# Altium schematic sheet Power_supply.SchDoc
size A4; SheetNumber: 2; SheetTotal: 7
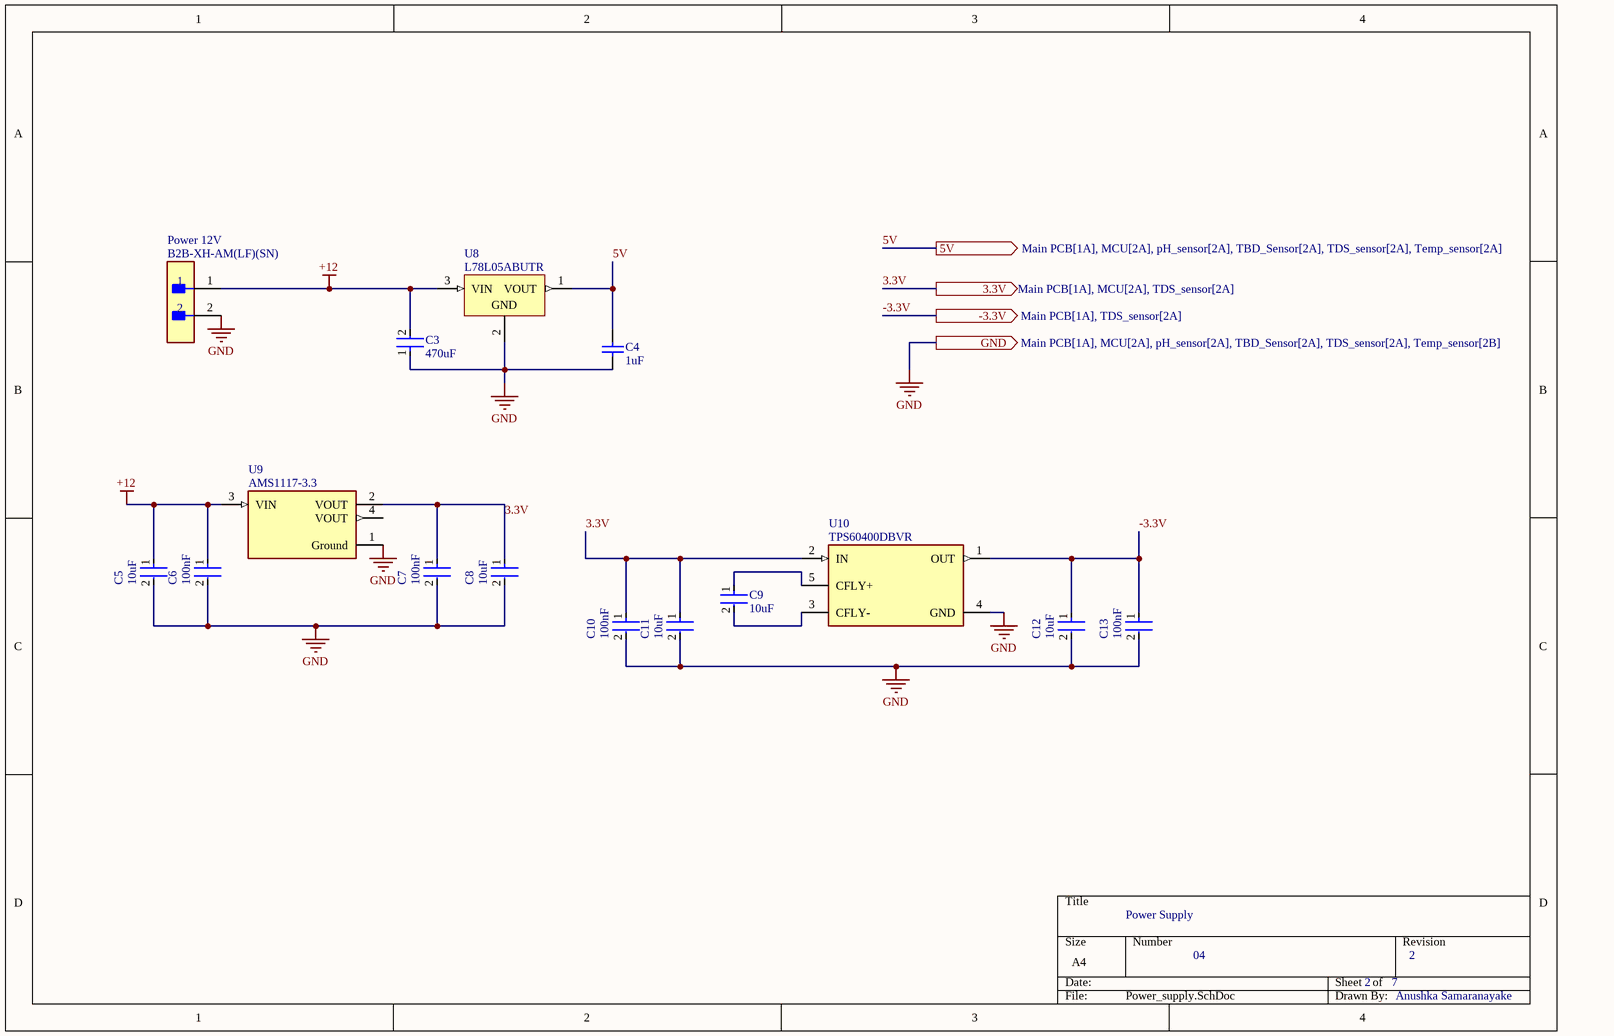
[diagram p0: Power_supply.SchDoc]

## Parts
C3  470uF  [FP-CL31-IPC_B]
C4  1uF  [CAPC2013X135X50LL15T20]
C5  10uF  [FP-CL31-IPC_B]
C6  100nF  [FP-CL31-IPC_B]
C7  100nF  [FP-CL31-IPC_B]
C8  10uF  [FP-CL31-IPC_B]
C9  10uF  [FP-CL31-IPC_B]
C10  100nF  [FP-CL31-IPC_B]
C11  10uF  [FP-CL31-IPC_B]
C12  10uF  [FP-CL31-IPC_B]
C13  100nF  [FP-CL31-IPC_B]
Power_12V  B2B-XH-AM(LF)(SN)  [FP-B2B-XH-AM_LF_SN-MFG]
U8  L78L05ABUTR  [SOT-89_N]
U9  AMS1117-3.3  [FP-AMS1117-IPC_C]
U10  TPS60400DBVR  [FP-DBV0005A-IPC_B]

## Ports
3.3V (out, see Main PCB[1A], MCU[2A], TDS_sensor[2A]), 5V (out, see Main PCB[1A], MCU[2A], pH_sensor[2A], TBD_Sensor[2A], TDS_sensor[2A], Temp_sensor[2A]), -3.3V (out, see Main PCB[1A], TDS_sensor[2A]), GND (out, see Main PCB[1A], MCU[2A], pH_sensor[2A], TBD_Sensor[2A], TDS_sensor[2A], Temp_sensor[2B])

## Nets
+12: C3.2 C5.1 C6.1 Power_12V.1 U8.3(VIN) U9.3(VIN)
GND: C3.1 C4.1 C5.2 C6.2 C7.2 C8.2 C10.2 C11.2 C12.2 C13.2 Power_12V.2 U8.2(GND) U9.1(Ground) U10.4(GND) ; port GND
3.3V: C7.1 C8.1 C10.1 C11.1 U9.2(VOUT) U10.2(IN) ; port 3.3V
5V: C4.2 U8.1(VOUT) ; port 5V
-3.3V: C12.1 C13.1 U10.1(OUT) ; port -3.3V
NetC9_1: C9.1 U10.5(CFLY+)
NetC9_2: C9.2 U10.3(CFLY-)

Not connected (* = marked no-connect by the designer): U9 4(VOUT)

## Notes on the sheet
- Power Supply
- 04
- 2
- 7
- Anushka Samaranayake

## Library data of the parts
C3 C5-C13 = CMP-13271-001731-1: Cap Ceramic 100nF 50V X7R ±10% SMD 1206 +125°C Embossed T/R; Voltage: 50V; Thickness: 0.037inch; Lead Free: Lead Free; Length: 3.2mm; Min Operating Temperature: -55°C; Package Quantity: 15000; Packaging: Tape and Reel; Mount: Surface Mount; Depth: 1.6mm; Case/Package: 1206; Voltage Rating (DC): 50V; Tolerance: 10%; Height: 0.85mm; Capacitance: 100nF; Radiation Hardening: No; Dielectric: X7R; Voltage Rating: 50V; Max Operating Temperature: 125°C; Width: 0.063inch
C4 = CMP-2007-03437-1: Manufacturer: Vitramon; Part Number: VJ0805Y102KXACW1BC
Power_12V = CMP-17439-000037-1: CONN HEADER VERT 2POS 2.5MM; Max Voltage Rating (AC): 250V; Connector Type: Male Pin; Contact Resistance: 20mR; Max Current Rating: 3A; Number of Positions: 2; Series: XH; Contact Material: Brass; Mount: Through Hole; Housing Material: Polyamide; Contact Plating: Tin; Termination: Solder; Max Operating Temperature: 85°C; Depth: 5.75mm; Packaging: Bulk; Min Operating Temperature: -25°C; Contact Type: Male Pin; Color: Green; Pitch: 2.5mm; Length: 7.4mm; Lead Free: Lead Free; Number of Rows: 1; Fastening Type: Detent; Housing Color: White; Orientation: Straight
U8 = CMP-0244-00406-1: Positive Voltage Regulator, 5V, 4-Pin SOT-89, Tape and Reel; PackageVersion: 2011; DatasheetVersion: 1/02/2011; PackageDescription: 3-Pin SOT-89 Package 1.5 mm Pitch, 4.1 mm Lead Span; PackageReference: SOT-89; ComponentLink2Description: Datasheet; ComponentLink1URL: http://www.st.com; ComponentLink1Description: Manufacturer URL; ComponentLink2URL: http://www.st.com/internet/com/TECHNICAL_RESOURCES/TECHNICAL_LITERATURE/DATASHEET/CD00000446.pdf
U9 = CMP-209535-000001-1: LDO Voltage Regulators 1A, 3.3V; Manufacturer: Advanced Monolithic Systems; Dropout Voltage: 1.1V; Output Type: Fixed; Nominal Supply Current: 5mA; Max Power Dissipation: 1.2W; Max Supply Voltage: 15V; Number Of Outputs: 1; Standoff Height: 0.64mm; Max Junction Temp: +125°C; Height: 1.8mm; Package: AMS1117; Device Class L2: Power Management ICs; ComponentLink2Description: Datasheet; ComponentLink2URL: http://www.advanced-monolithic.com/pdf/ds1117.pdf; Category: IC; RoHS: TRUE; Automotive: No; Device Class L1: Integrated Circuits (ICs); Output Current: 1A; Device Class L3: Voltage Regulators - Linear; Temperature: -40°C to +125°C; Output Voltage: 3.3V; Manufacturer Part Number: AMS1117-3.3; Temperature Range Low: -40°C; Octopart: https://octopart.com/ams1117-3.3-advanced+monolithic+systems-25899300; Lead Free: Yes; Ipc Land Pattern Name: SOT229P700X180-4; Temperature Range High: +125°C
U10 = CMP-0391-00019-3: IC REG CHARG PUMP INV 60MA SOT23; Number of Outputs: 1; Min Supply Voltage: 1.8V; Max Supply Voltage: 5.25V; Max Output Voltage: -5.25V; Operating Supply Current: 125uA; Logic Function: Inverting; Min Output Voltage: -1.6V; Output Type: Adjustable; Switching Frequency: 250kHz; Synchronous Rectifier: No; Min Operating Temperature: -40°C; Number of Pins: 5; Package Quantity: 3000; Min Input Voltage: 1.8V; Max Operating Temperature: 85°C; Packaging: Tape and Reel; Output Current: 60mA; Max Input Voltage: 5.25V; Weight: 0.000459oz; Lead Free: Lead Free; Output Voltage: -5.25V; Contact Plating: Gold; Radiation Hardening: No; Quiescent Current: 125uA; Max Output Current: 60mA; REACH SVHC: No SVHC; Case/Package: SOT-23-5